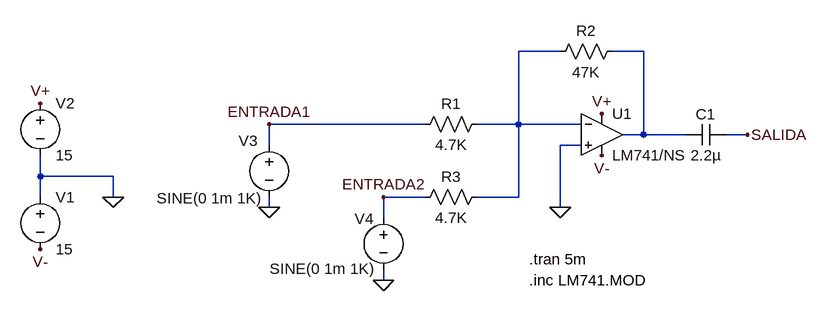
[diagram p0: schematic lm741-mezclador.asc]
lm741-mezclador.asc, the LTspice schematic file:
Version 4
SHEET 1 908 680
WIRE 352 48 288 48
WIRE 480 48 432 48
WIRE 144 160 -96 160
WIRE 288 160 288 48
WIRE 288 160 224 160
WIRE 384 160 288 160
WIRE 480 176 480 48
WIRE 480 176 448 176
WIRE 544 176 480 176
WIRE 640 176 608 176
WIRE -96 192 -96 160
WIRE 384 192 352 192
WIRE -448 240 -448 208
WIRE -336 240 -448 240
WIRE -448 272 -448 240
WIRE -336 272 -336 240
WIRE 144 272 80 272
WIRE 288 272 288 160
WIRE 288 272 224 272
WIRE -96 288 -96 272
WIRE 352 288 352 192
WIRE 80 304 80 272
WIRE 80 400 80 384
FLAG -96 288 0
FLAG -336 272 0
FLAG 640 176 SALIDA
FLAG -448 128 V+
FLAG 416 144 V+
FLAG -448 352 V-
FLAG 416 208 V-
FLAG 352 288 0
FLAG -96 160 ENTRADA1
FLAG 80 400 0
FLAG 80 272 ENTRADA2
SYMBOL Opamps\\opamp2 416 112 R0
SYMATTR InstName U1
SYMATTR Value LM741/NS
SYMBOL voltage -448 256 R0
WINDOW 123 0 0 Left 0
WINDOW 39 0 0 Left 0
SYMATTR InstName V1
SYMATTR Value 15
SYMBOL voltage -448 112 R0
WINDOW 123 0 0 Left 0
WINDOW 39 0 0 Left 0
SYMATTR InstName V2
SYMATTR Value 15
SYMBOL voltage -96 176 R0
WINDOW 123 0 0 Left 0
WINDOW 39 0 0 Left 0
WINDOW 0 -47 9 Left 2
WINDOW 3 -173 98 Left 2
SYMATTR InstName V3
SYMATTR Value SINE(0 1m 1K)
SYMBOL res 448 32 R90
WINDOW 0 0 56 VBottom 2
WINDOW 3 32 56 VTop 2
SYMATTR InstName R2
SYMATTR Value 47K
SYMBOL res 240 144 R90
WINDOW 0 0 56 VBottom 2
WINDOW 3 32 56 VTop 2
SYMATTR InstName R1
SYMATTR Value 4.7K
SYMBOL cap 608 160 R90
WINDOW 0 0 32 VBottom 2
WINDOW 3 32 32 VTop 2
SYMATTR InstName C1
SYMATTR Value 2.2µ
SYMBOL voltage 80 288 R0
WINDOW 123 0 0 Left 0
WINDOW 39 0 0 Left 0
WINDOW 0 -44 17 Left 2
WINDOW 3 -175 94 Left 2
SYMATTR InstName V4
SYMATTR Value SINE(0 1m 1K)
SYMBOL res 240 256 R90
WINDOW 0 0 56 VBottom 2
WINDOW 3 32 56 VTop 2
SYMATTR InstName R3
SYMATTR Value 4.7K
TEXT 304 368 Left 2 !.tran 5m
TEXT 304 400 Left 2 !.inc LM741.MOD

The netlist it stands for:
* lm741-mezclador.asc
XU1 0 N001 V+ V- N002 LM741/NS  ; pins In+ In- V+ V- OUT
V1 0 V- 15
V2 V+ 0 15
V3 ENTRADA1 0 SINE(0 1m 1K)
R2 N002 N001 47K
R1 N001 ENTRADA1 4.7K
C1 SALIDA N002 2.2µ
V4 ENTRADA2 0 SINE(0 1m 1K)
R3 N001 ENTRADA2 4.7K
.tran 5m
.inc LM741.MOD
.backanno
.end